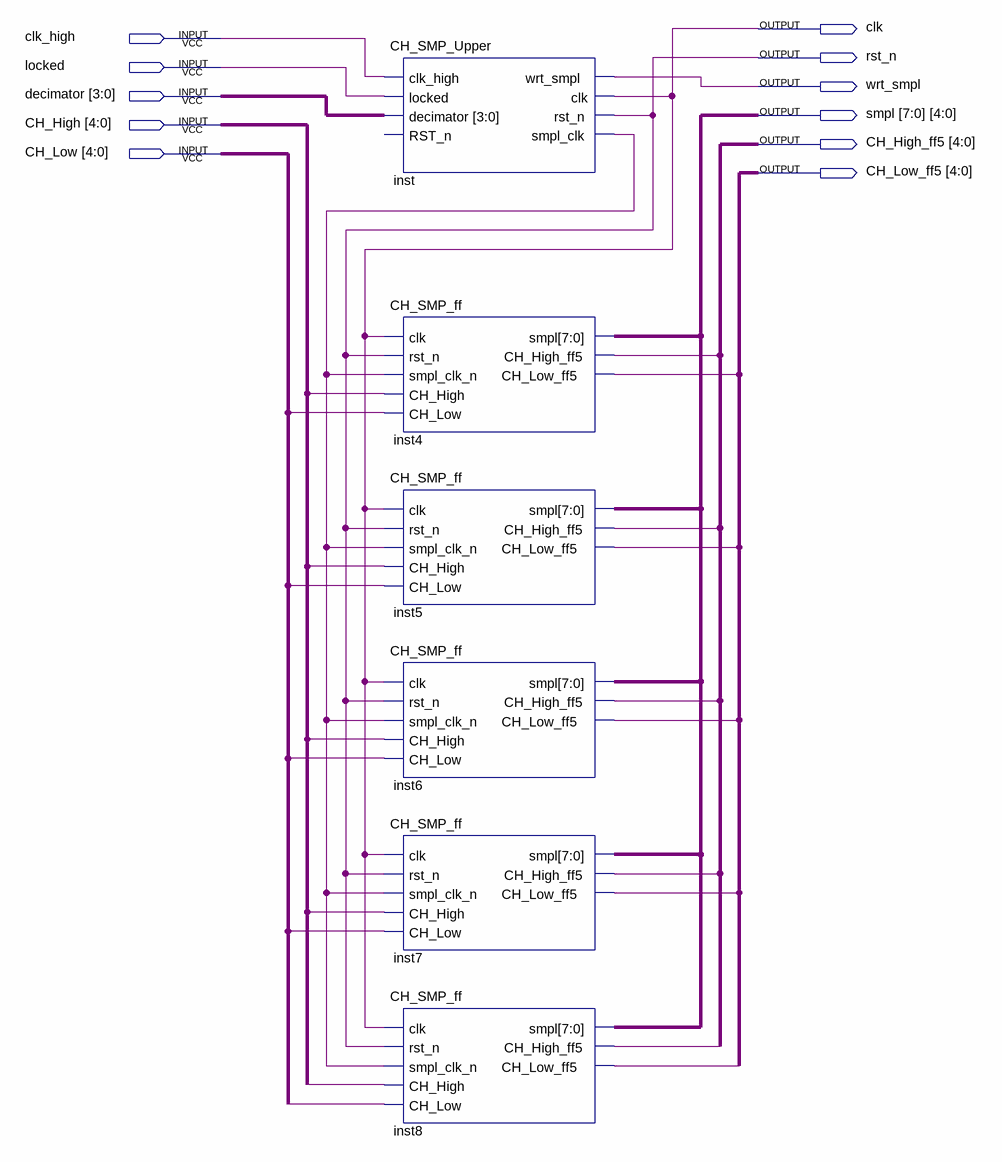
[diagram p0: schematic sheet]
// Quartus schematic Sample_Logic.bdf as structural Verilog: 6 symbols, 11 pins
module Sample_Logic (
  input  clk_high,
  input  locked,
  input  [3:0] decimator,
  input  [4:0] CH_High,
  input  [4:0] CH_Low,
  output clk,
  output rst_n,
  output wrt_smpl,
  output [4:0] \smpl_[7..0] ,
  output [4:0] CH_High_ff5,
  output [4:0] CH_Low_ff5
);

  wire inst4_ch_high_ff5, inst4_ch_low_ff5, inst5_ch_high_ff5, inst5_ch_low_ff5, inst6_ch_high_ff5,
       inst6_ch_low_ff5, inst7_ch_high_ff5, inst7_ch_low_ff5, inst8_ch_high_ff5, inst8_ch_low_ff5,
       inst_smpl_clk, undriven, undriven_2, undriven_3, undriven_4, undriven_5, undriven_6, undriven_7,
       undriven_8, undriven_9, undriven_10;

  CH_SMP_Upper inst (
    .clk_high(clk_high), .locked(locked), .decimator(decimator), .wrt_smpl(wrt_smpl), .clk(clk),
    .rst_n(rst_n), .smpl_clk(inst_smpl_clk));  // open: RST_n
  CH_SMP_ff inst4 (
    .clk(clk), .rst_n(rst_n), .smpl_clk_n(inst_smpl_clk), .CH_High(undriven_5), .CH_Low(undriven_6),
    .smpl(\smpl_[7..0] ), .CH_High_ff5(inst4_ch_high_ff5), .CH_Low_ff5(inst4_ch_low_ff5));
  CH_SMP_ff inst5 (
    .clk(clk), .rst_n(rst_n), .smpl_clk_n(inst_smpl_clk), .CH_High(undriven_4), .CH_Low(undriven_7),
    .smpl(\smpl_[7..0] ), .CH_High_ff5(inst5_ch_high_ff5), .CH_Low_ff5(inst5_ch_low_ff5));
  CH_SMP_ff inst6 (
    .clk(clk), .rst_n(rst_n), .smpl_clk_n(inst_smpl_clk), .CH_High(undriven_3), .CH_Low(undriven_8),
    .smpl(\smpl_[7..0] ), .CH_High_ff5(inst6_ch_high_ff5), .CH_Low_ff5(inst6_ch_low_ff5));
  CH_SMP_ff inst7 (
    .clk(clk), .rst_n(rst_n), .smpl_clk_n(inst_smpl_clk), .CH_High(undriven_2), .CH_Low(undriven_9),
    .smpl(\smpl_[7..0] ), .CH_High_ff5(inst7_ch_high_ff5), .CH_Low_ff5(inst7_ch_low_ff5));
  CH_SMP_ff inst8 (
    .clk(clk), .rst_n(rst_n), .smpl_clk_n(inst_smpl_clk), .CH_High(undriven), .CH_Low(undriven_10),
    .smpl(\smpl_[7..0] ), .CH_High_ff5(inst8_ch_high_ff5), .CH_Low_ff5(inst8_ch_low_ff5));
endmodule
